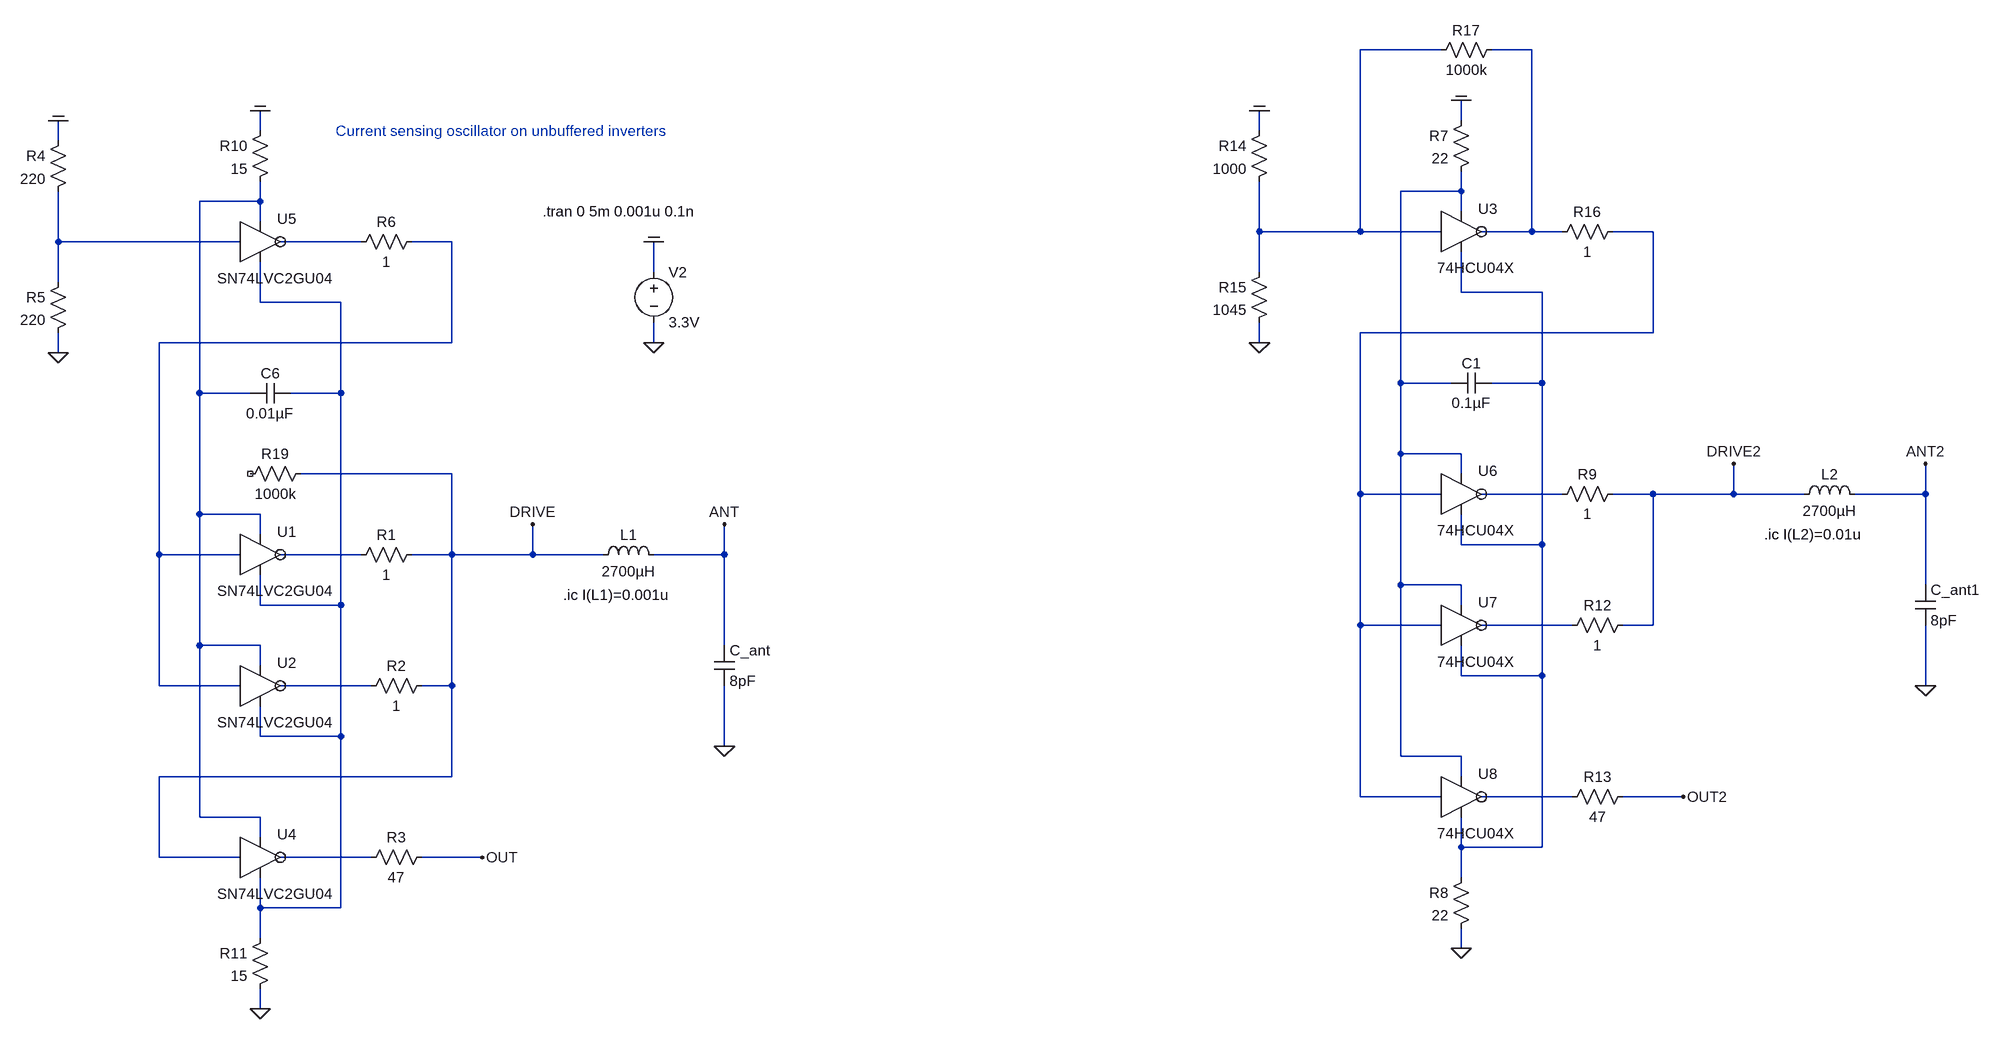
[diagram p0: schematic 2021_current_sensing_unbuffered_inverters_01.asc]
2021_current_sensing_unbuffered_inverters_01.asc, the LTspice schematic file:
Version 4
SHEET 1 13280 8692
WIRE 4512 4384 4384 4384
WIRE 4656 4384 4592 4384
WIRE 4544 4496 4544 4464
WIRE 2640 4512 2640 4480
WIRE 4224 4512 4224 4480
WIRE 2320 4528 2320 4496
WIRE 4544 4608 4544 4576
WIRE 4544 4608 4448 4608
WIRE 2640 4624 2640 4592
WIRE 2640 4624 2544 4624
WIRE 4544 4640 4544 4608
WIRE 2640 4656 2640 4624
WIRE 4224 4672 4224 4592
WIRE 4384 4672 4384 4384
WIRE 4384 4672 4224 4672
WIRE 4512 4672 4384 4672
WIRE 4656 4672 4656 4384
WIRE 4656 4672 4576 4672
WIRE 4704 4672 4656 4672
WIRE 4848 4672 4784 4672
WIRE 2320 4688 2320 4608
WIRE 2608 4688 2320 4688
WIRE 2800 4688 2672 4688
WIRE 2944 4688 2880 4688
WIRE 3264 4736 3264 4688
WIRE 4224 4736 4224 4672
WIRE 2320 4752 2320 4688
WIRE 4544 4768 4544 4704
WIRE 4672 4768 4544 4768
WIRE 2640 4784 2640 4720
WIRE 2768 4784 2640 4784
WIRE 4848 4832 4848 4672
WIRE 4848 4832 4384 4832
WIRE 2944 4848 2944 4688
WIRE 2944 4848 2480 4848
WIRE 3264 4848 3264 4816
WIRE 4224 4848 4224 4816
WIRE 2320 4864 2320 4832
WIRE 4448 4912 4448 4608
WIRE 4528 4912 4448 4912
WIRE 4672 4912 4672 4768
WIRE 4672 4912 4592 4912
WIRE 2544 4928 2544 4624
WIRE 2624 4928 2544 4928
WIRE 2768 4928 2768 4784
WIRE 2768 4928 2688 4928
WIRE 4448 5024 4448 4912
WIRE 4544 5024 4448 5024
WIRE 2944 5056 2704 5056
WIRE 4544 5056 4544 5024
WIRE 4384 5088 4384 4832
WIRE 4512 5088 4384 5088
WIRE 4704 5088 4576 5088
WIRE 4848 5088 4784 5088
WIRE 4976 5088 4976 5040
WIRE 4976 5088 4848 5088
WIRE 5088 5088 4976 5088
WIRE 5280 5088 5280 5040
WIRE 5280 5088 5168 5088
WIRE 2544 5120 2544 4928
WIRE 2640 5120 2544 5120
WIRE 2640 5152 2640 5120
WIRE 4544 5168 4544 5120
WIRE 4672 5168 4672 4912
WIRE 4672 5168 4544 5168
WIRE 2480 5184 2480 4848
WIRE 2608 5184 2480 5184
WIRE 2800 5184 2672 5184
WIRE 2944 5184 2944 5056
WIRE 2944 5184 2880 5184
WIRE 3072 5184 3072 5136
WIRE 3072 5184 2944 5184
WIRE 3184 5184 3072 5184
WIRE 3376 5184 3376 5136
WIRE 3376 5184 3264 5184
WIRE 4448 5232 4448 5024
WIRE 4544 5232 4448 5232
WIRE 5280 5232 5280 5088
WIRE 2640 5264 2640 5216
WIRE 2768 5264 2768 4928
WIRE 2768 5264 2640 5264
WIRE 4544 5264 4544 5232
WIRE 4384 5296 4384 5088
WIRE 4512 5296 4384 5296
WIRE 4720 5296 4576 5296
WIRE 4848 5296 4848 5088
WIRE 4848 5296 4800 5296
WIRE 2544 5328 2544 5120
WIRE 2640 5328 2544 5328
WIRE 3376 5328 3376 5184
WIRE 2640 5360 2640 5328
WIRE 4544 5376 4544 5328
WIRE 4672 5376 4672 5168
WIRE 4672 5376 4544 5376
WIRE 2480 5392 2480 5184
WIRE 2608 5392 2480 5392
WIRE 2816 5392 2672 5392
WIRE 2944 5392 2944 5184
WIRE 2944 5392 2896 5392
WIRE 5280 5392 5280 5296
WIRE 2640 5472 2640 5424
WIRE 2768 5472 2768 5264
WIRE 2768 5472 2640 5472
WIRE 3376 5488 3376 5392
WIRE 4448 5504 4448 5232
WIRE 4544 5504 4448 5504
WIRE 2944 5536 2944 5392
WIRE 2944 5536 2480 5536
WIRE 4544 5536 4544 5504
WIRE 4384 5568 4384 5296
WIRE 4512 5568 4384 5568
WIRE 4720 5568 4576 5568
WIRE 4896 5568 4800 5568
WIRE 2544 5600 2544 5328
WIRE 2640 5600 2544 5600
WIRE 2640 5632 2640 5600
WIRE 4544 5648 4544 5600
WIRE 4672 5648 4672 5376
WIRE 4672 5648 4544 5648
WIRE 2480 5664 2480 5536
WIRE 2608 5664 2480 5664
WIRE 2816 5664 2672 5664
WIRE 2992 5664 2896 5664
WIRE 4544 5696 4544 5648
WIRE 2640 5744 2640 5696
WIRE 2768 5744 2768 5472
WIRE 2768 5744 2640 5744
WIRE 2640 5792 2640 5744
WIRE 4544 5808 4544 5776
WIRE 2640 5904 2640 5872
FLAG 3264 4848 0
FLAG 3264 4688 COM
FLAG 2640 4480 COM
FLAG 2640 5904 0
FLAG 3376 5488 0
FLAG 3376 5136 ANT
FLAG 3072 5136 DRIVE
FLAG 2992 5664 OUT
FLAG 2320 4496 COM
FLAG 2320 4864 0
FLAG 4544 4464 COM
FLAG 4544 5808 0
FLAG 5280 5392 0
FLAG 5280 5040 ANT2
FLAG 4976 5040 DRIVE2
FLAG 4896 5568 OUT2
FLAG 4224 4480 COM
FLAG 4224 4848 0
SYMBOL voltage 3264 4720 R0
WINDOW 123 0 0 Left 2
WINDOW 39 0 0 Left 2
SYMATTR InstName V2
SYMATTR Value 3.3V
SYMBOL res 2656 4496 M0
WINDOW 0 36 40 Left 2
WINDOW 3 36 76 Left 2
SYMATTR InstName R10
SYMATTR Value 15
SYMBOL res 2656 5776 M0
WINDOW 0 36 40 Left 2
WINDOW 3 36 76 Left 2
SYMATTR InstName R11
SYMATTR Value 15
SYMBOL ind 3168 5200 R270
WINDOW 0 32 56 VTop 2
WINDOW 3 5 56 VBottom 2
SYMATTR InstName L1
SYMATTR Value 2700µH
SYMATTR SpiceLine Rser=120 Cpar=1.2pF
SYMBOL cap 3360 5328 R0
SYMATTR InstName C_ant
SYMATTR Value 8pF
SYMBOL cap 2688 4912 R90
WINDOW 0 0 32 VBottom 2
WINDOW 3 32 32 VTop 2
SYMATTR InstName C6
SYMATTR Value 0.01µF
SYMBOL SN74LVC2GU04 2640 5184 R0
SYMATTR InstName U1
SYMBOL SN74LVC2GU04 2640 5392 R0
SYMATTR InstName U2
SYMBOL res 2896 5168 R90
WINDOW 0 0 56 VBottom 2
WINDOW 3 32 56 VTop 2
SYMATTR InstName R1
SYMATTR Value 1
SYMBOL res 2912 5376 R90
WINDOW 0 0 56 VBottom 2
WINDOW 3 32 56 VTop 2
SYMATTR InstName R2
SYMATTR Value 1
SYMBOL SN74LVC2GU04 2640 5664 R0
SYMATTR InstName U4
SYMBOL res 2912 5648 R90
WINDOW 0 0 56 VBottom 2
WINDOW 3 32 56 VTop 2
SYMATTR InstName R3
SYMATTR Value 47
SYMBOL res 2336 4512 M0
WINDOW 0 36 40 Left 2
WINDOW 3 36 76 Left 2
SYMATTR InstName R4
SYMATTR Value 220
SYMBOL res 2336 4736 M0
WINDOW 0 36 40 Left 2
WINDOW 3 36 76 Left 2
SYMATTR InstName R5
SYMATTR Value 220
SYMBOL SN74LVC2GU04 2640 4688 R0
SYMATTR InstName U5
SYMBOL res 2896 4672 R90
WINDOW 0 0 56 VBottom 2
WINDOW 3 32 56 VTop 2
SYMATTR InstName R6
SYMATTR Value 1
SYMBOL res 4560 4480 M0
WINDOW 0 36 40 Left 2
WINDOW 3 36 76 Left 2
SYMATTR InstName R7
SYMATTR Value 22
SYMBOL res 4560 5680 M0
WINDOW 0 36 40 Left 2
WINDOW 3 36 76 Left 2
SYMATTR InstName R8
SYMATTR Value 22
SYMBOL ind 5072 5104 R270
WINDOW 0 32 56 VTop 2
WINDOW 3 5 56 VBottom 2
SYMATTR InstName L2
SYMATTR Value 2700µH
SYMATTR SpiceLine Rser=120 Cpar=1.2pF
SYMBOL cap 5264 5232 R0
SYMATTR InstName C_ant1
SYMATTR Value 8pF
SYMBOL cap 4592 4896 R90
WINDOW 0 0 32 VBottom 2
WINDOW 3 32 32 VTop 2
SYMATTR InstName C1
SYMATTR Value 0.1µF
SYMBOL res 4800 5072 R90
WINDOW 0 0 56 VBottom 2
WINDOW 3 32 56 VTop 2
SYMATTR InstName R9
SYMATTR Value 1
SYMBOL res 4816 5280 R90
WINDOW 0 0 56 VBottom 2
WINDOW 3 32 56 VTop 2
SYMATTR InstName R12
SYMATTR Value 1
SYMBOL res 4816 5552 R90
WINDOW 0 0 56 VBottom 2
WINDOW 3 32 56 VTop 2
SYMATTR InstName R13
SYMATTR Value 47
SYMBOL res 4240 4496 M0
WINDOW 0 36 40 Left 2
WINDOW 3 36 76 Left 2
SYMATTR InstName R14
SYMATTR Value 1000
SYMBOL res 4240 4720 M0
WINDOW 0 36 40 Left 2
WINDOW 3 36 76 Left 2
SYMATTR InstName R15
SYMATTR Value 1045
SYMBOL res 4800 4656 R90
WINDOW 0 0 56 VBottom 2
WINDOW 3 32 56 VTop 2
SYMATTR InstName R16
SYMATTR Value 1
SYMBOL 74HCU04X 4544 4672 R0
SYMATTR InstName U3
SYMBOL 74HCU04X 4544 5088 R0
SYMATTR InstName U6
SYMBOL 74HCU04X 4544 5296 R0
SYMATTR InstName U7
SYMBOL 74HCU04X 4544 5568 R0
SYMATTR InstName U8
SYMBOL res 4608 4368 R90
WINDOW 0 0 56 VBottom 2
WINDOW 3 32 56 VTop 2
SYMATTR InstName R17
SYMATTR Value 1000k
SYMBOL res 2720 5040 R90
WINDOW 0 0 56 VBottom 2
WINDOW 3 32 56 VTop 2
SYMATTR InstName R19
SYMATTR Value 1000k
TEXT 3088 4640 Left 2 !.tran 0 5m 0.001u 0.1n
TEXT 3120 5248 Left 2 !.ic I(L1)=0.001u
TEXT 5024 5152 Left 2 !.ic I(L2)=0.01u
TEXT 2760 4512 Left 2 ;Current sensing oscillator on unbuffered inverters

The netlist it stands for:
* 2021_current_sensing_unbuffered_inverters_01.asc
V2 COM 0 3.3V
R10 COM N004 15
R11 N010 0 15
L1 DRIVE ANT 2700µH Rser=120 Cpar=1.2pF
C_ant ANT 0 8pF
C6 N010 N004 0.01µF
XU1 N012 N008 N004 N010 SN74LVC2GU04  ; pins Y A VCC AGND
XU2 N014 N008 N004 N010 SN74LVC2GU04  ; pins Y A VCC AGND
R1 DRIVE N012 1
R2 DRIVE N014 1
XU4 N016 DRIVE N004 N010 SN74LVC2GU04  ; pins Y A VCC AGND
R3 OUT N016 47
R4 COM N006 220
R5 N006 0 220
XU5 N007 N006 N004 N010 SN74LVC2GU04  ; pins Y A VCC AGND
R6 N008 N007 1
R7 COM N003 22
R8 N009 0 22
L2 DRIVE2 ANT2 2700µH Rser=120 Cpar=1.2pF
C_ant1 ANT2 0 8pF
C1 N009 N003 0.1µF
R9 DRIVE2 N011 1
R12 DRIVE2 N013 1
R13 OUT2 N015 47
R14 COM N001 1000
R15 N001 0 1045
R16 N005 N002 1
XU3 N001 N002 N003 N009 74HCU04X  ; pins A Y VCC AGND
XU6 N005 N011 N003 N009 74HCU04X  ; pins A Y VCC AGND
XU7 N005 N013 N003 N009 74HCU04X  ; pins A Y VCC AGND
XU8 N005 N015 N003 N009 74HCU04X  ; pins A Y VCC AGND
R17 N002 N001 1000k
R19 DRIVE NC_01 1000k
.tran 0 5m 0.001u 0.1n
.ic I(L1)=0.001u
.ic I(L2)=0.01u
* Current sensing oscillator on unbuffered inverters
.lib SN74LVC2GU04.cir
.lib 74HCU04X.cir
.backanno
.end